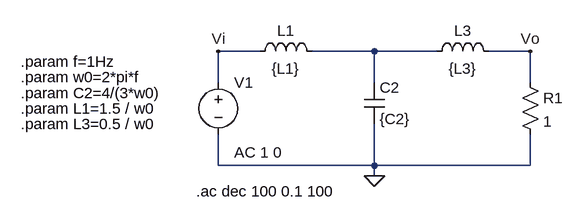
[diagram p0: schematic Punto2.asc]
Punto2.asc, the LTspice schematic file:
Version 4
SHEET 1 880 680
WIRE -32 112 -96 112
WIRE 144 112 48 112
WIRE 240 112 144 112
WIRE 384 112 320 112
WIRE -96 160 -96 112
WIRE 144 160 144 112
WIRE 384 160 384 112
WIRE -96 288 -96 240
WIRE 144 288 144 224
WIRE 144 288 -96 288
WIRE 384 288 384 240
WIRE 384 288 144 288
WIRE 144 304 144 288
FLAG 144 304 0
FLAG -96 112 Vi
FLAG 384 112 Vo
SYMBOL ind -48 128 R270
WINDOW 0 32 56 VTop 2
WINDOW 3 5 56 VBottom 2
SYMATTR InstName L1
SYMATTR Value {L1}
SYMBOL ind 224 128 R270
WINDOW 0 32 56 VTop 2
WINDOW 3 5 56 VBottom 2
SYMATTR InstName L3
SYMATTR Value {L3}
SYMBOL cap 128 160 R0
SYMATTR InstName C2
SYMATTR Value {C2}
SYMBOL res 368 144 R0
SYMATTR InstName R1
SYMATTR Value 1
SYMBOL voltage -96 144 R0
WINDOW 123 24 124 Left 2
WINDOW 39 0 0 Left 0
SYMATTR InstName V1
SYMATTR Value ""
SYMATTR Value2 AC 1 0
TEXT -130 328 Left 2 !.ac dec 100 0.1 100
TEXT -400 128 Left 2 !.param f=1Hz
TEXT -400 152 Left 2 !.param w0=2*pi*f
TEXT -400 176 Left 2 !.param C2=4/(3*w0)
TEXT -400 200 Left 2 !.param L1=1.5 / w0
TEXT -400 224 Left 2 !.param L3=0.5 / w0

The netlist it stands for:
* Punto2.asc
L1 Vi N001 {L1}
L3 N001 Vo {L3}
C2 N001 0 {C2}
R1 Vo 0 1
V1 Vi 0 AC 1 0
.ac dec 100 0.1 100
.param f=1Hz
.param w0=2*pi*f
.param C2=4/(3*w0)
.param L1=1.5 / w0
.param L3=0.5 / w0
.backanno
.end